# Altium schematic sheet 5V_Converter.SchDoc
size A
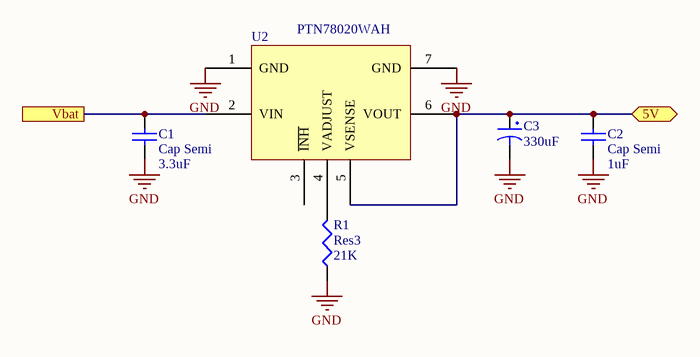
[diagram p0: 5V_Converter.SchDoc]

## Parts
C1  Cap Semi  value 3.3uF  [C1206]
C2  Cap Semi  value 1uF  [C1206]
C3  330uF  [UUR1A331]
R1  Res3  value 21K  [J1-0603]
U2  PTN78020WAH  [PTN78020WAH]

## Ports
5V (bidir), Vbat

## Nets
GND: C1.1 C2.1 C3.2 R1.1 U2.1(GND) U2.7(GND)
5V: C2.2 C3.1 U2.5(VSENSE) U2.6(VOUT) ; port 5V
Vbat: C1.2 U2.2(VIN) ; port Vbat
NetR1_2: R1.2 U2.4(VADJUST)

Not connected (* = marked no-connect by the designer): U2 3(~{INH})

## Library data of the parts
C1 C2 = Cap Semi: Capacitor (Semiconductor SIM Model); Published: 8-Jun-2000; LatestRevisionDate: 29-May-2009; LatestRevisionNote: IPC-7351 Footprint Added.; PackageReference: C1206; Publisher: Altium Limited; PackageDescription: Chip Capacitor
C3 = PCV1E391MCL2GS: CAP ALUM POLY 390UF 20% 25V SMD; Digikey: https://www.digikey.com/product-detail/en/nichicon/PCV1E391MCL2GS/493-4544-1-ND/2786841; Datasheet: http://nichicon-us.com/english/products/pdfs/e-pcv.pdf
R1 = Res3: Resistor; Published: 8-Jun-2000; LatestRevisionDate: 29-May-2009; LatestRevisionNote: IPC-7351 Footprint Added.; PackageReference: J1-0603; Publisher: Altium Limited; PackageDescription: Chip Resistor
U2 = PTN78020WAH: 6A DC DC Converter